# Altium schematic sheet b2b_connector.SchDoc: DiPho AFE
size 420 x 297 mm; Author: P. Daniel; DrawnBy: P. Daniel; Address1: WUT ISE; Address3: piotrmaciejdaniel@gmail.com; SheetNumber: 4; SheetTotal: 4; ModifiedBy: -; CreateDate: 10-12.2021; CheckedDate: -; Title2: b2b con schematic; DivGrp: WUT ISE; Designer: Piotr Daniel
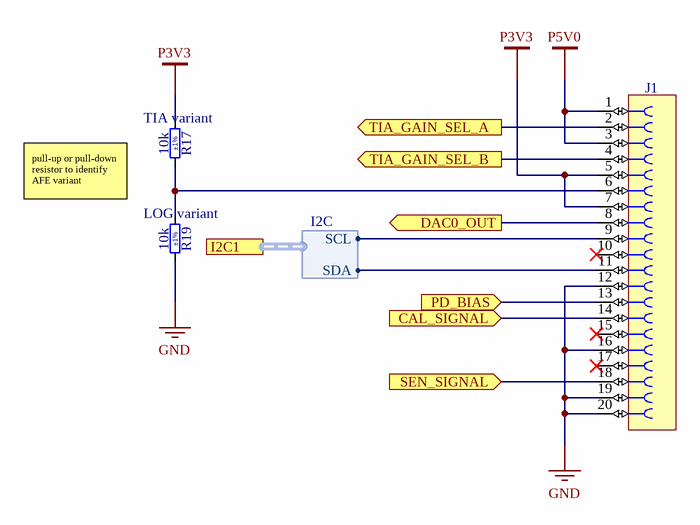
[diagram p0: b2b_connector.SchDoc]

## Parts
J1  SlimStack™  [MOLEX_52991-0208]  (value not drawn)
R17  10k  Tolerance: ±1%  [RESC1005X40N]
R19  10k  Tolerance: ±1%  [RESC1005X40N]

## Ports
CAL_SIGNAL (in), DAC0_OUT (out), I2C1 (harness I2C), PD_BIAS (in), SEN_SIGNAL (in), TIA_GAIN_SEL_A (out), TIA_GAIN_SEL_B (out)

## Harnesses
I2C: SCL, SDA

## Nets
GND: J1.12 J1.16 J1.19 J1.20 R19.1
P3V3: J1.5 J1.7 R17.2
P5V0: J1.1 J1.3
CAL_SIGNAL: J1.14 ; port CAL_SIGNAL
DAC0_OUT: J1.8 ; port DAC0_OUT
PD_BIAS: J1.13 ; port PD_BIAS
SEN_SIGNAL: J1.18 ; port SEN_SIGNAL
TIA_GAIN_SEL_A: J1.2 ; port TIA_GAIN_SEL_A
TIA_GAIN_SEL_B: J1.4 ; port TIA_GAIN_SEL_B
NetJ1_6: J1.6 R17.1 R19.2
NetJ1_9: J1.9 ; port I2C1.SCL
NetJ1_11: J1.11 ; port I2C1.SDA

Not connected (* = marked no-connect by the designer): J1 10* 15* 17*

## Notes on the sheet
- (near R17) TIA variant
- pull-up or pull-down resistor to identify AFE variant
- (near R19) LOG variant
- Project/Equipment
- Document
- Designer
- Drawn by
- Check.by
- Copyright WUT ISE 2021.
  This documentation describes Open Hardware and is licensed under the CERN OHL v.1.1. You may redistribute and modify this documentation under the terms of the CERN OHL v.1.1. (http://ohwr.org/CERNOHL). This documentation is distributed WITHOUT ANY EXPRESS OR IMPLIED WARRANTY, INCLUDING OF MERCHANTABILITY, SATISFACTORY QUALITY AND FITNESS FOR A PARTICULAR PURPOSE. Please see the CERN OHL v.1.1 for applicable conditions.
- Contact
- File
- Last Mod.
- Print Date
- Sheet
- Size
- A3
- of
- Rev

## Library data of the parts
J1 = MOLEX_52991-0208: Connector 20 Female; Part Description: 0.50mm Pitch SlimStack™ Dual Row 20 Circuits Surface Mount Vertical Receptacle (3.00 and 4.00mm Stacking Heights); Manufacturer: MOLEX; PressFit: No; Part Number: MOLEX_52991-0208; Component Kind: Standard; Component Type: Standard; Pin Count: 20; Family: SlimStack™; Mounted: Yes; Socket: No; SMD: Yes; Sense: No; Status: None; Manufacturer Part Number: 52991-0208; ComponentHeight: 2.27mm; HelpURL: \\cern.ch\dfs\Applications\Altium\Datasheets\MOLEX_52991-0208.pdf; Author: CERN DEM BC; CreateDate: 09.12.2019; LatestRevisionDate: 09.12.2019
R17 R19 = R0402_10K_1%_0.0625W_100PPM: Resistor - 1%; Part Description: General Purpose Thick Film Chip Resistor; Manufacturer: GENERIC; Manufacturer1 Part Number: 232270671003L; TC: ±100ppm/°C; PressFit: No; Part Number: R0402_10K_1%_0.0625W_100PPM; Component Kind: Standard; Component Type: Standard; Pin Count: 2; Value: 10k; Status: Not Recommended; Power: 0.0625W; Manufacturer Part Number: R0402_10K_1%_0.0625W_100PPM; Case: 0402; Mounted: Yes; Sense: No; Socket: No; SMD: Yes; Manufacturer1 Example: YAGEO PHYCOMP; Manufacturer1 ComponentHeight: 0.4mm; HelpURL: \\cern.ch\dfs\Applications\Altium\Datasheets\R0402_Phycomp_RC0402.pdf; Author: CERN DEM JLC; CreateDate: 03.12.2007; LatestRevisionDate: 17.10.2012